# Altium schematic sheet TF.SchDoc
size A4
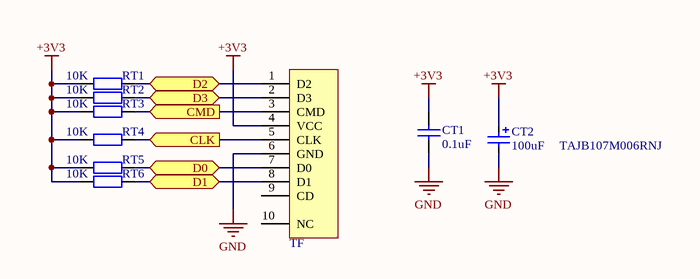
[diagram p0: TF.SchDoc]

## Parts
CT1  value 0.1uF  [CAPC1608N]  (hidden comment: Cap1)
CT2  value 100uF     TAJB107M006RNJ  [CAP_TAN_B_3518]  (hidden comment: Cap_Tan)
RT1  value 10K  [RESC1608N]  (hidden comment: Res1)
RT2  value 10K  [RESC1608N]  (hidden comment: Res1)
RT3  value 10K  [RESC1608N]  (hidden comment: Res1)
RT4  value 10K  [RESC1608N]  (hidden comment: Res1)
RT5  value 10K  [RESC1608N]  (hidden comment: Res1)
RT6  value 10K  [RESC1608N]  (hidden comment: Res1)
TF  TF  [TF-2]  (value not drawn)

## Ports
CLK (in), CMD (in), D0 (bidir), D1 (bidir), D2 (bidir), D3 (bidir)

## Nets
+3V3: CT1.2 CT2.1 RT1.1 RT2.1 RT3.1 RT4.1 RT5.1 RT6.1 TF.4(VCC)
GND: CT1.1 CT2.2 TF.6(GND)
CLK: RT4.2 TF.5(CLK) ; port CLK
CMD: RT3.2 TF.3(CMD) ; port CMD
D0: RT5.2 TF.7(D0) ; port D0
D1: RT6.2 TF.8(D1) ; port D1
D2: RT1.2 TF.1(D2) ; port D2
D3: RT2.2 TF.2(D3) ; port D3

Not connected (* = marked no-connect by the designer): TF 9(CD) 10(NC)

## Library data of the parts
CT1 = Cap1: Capacitor; Published: 8-Jun-2000; LatestRevisionDate: 17-Jul-2002; LatestRevisionNote: Re-released for DXP Platform.; PackageReference: RAD-0.3; Publisher: Altium Limited
CT2 = Cap_Tan: Capacitor
RT1-RT6 = Res1: Resistor; Published: 8-Jun-2000; LatestRevisionDate: 17-Jul-2002; LatestRevisionNote: Re-released for DXP Platform.; PackageReference: AXIAL-0.4; Publisher: Altium Limited
TF = TF2